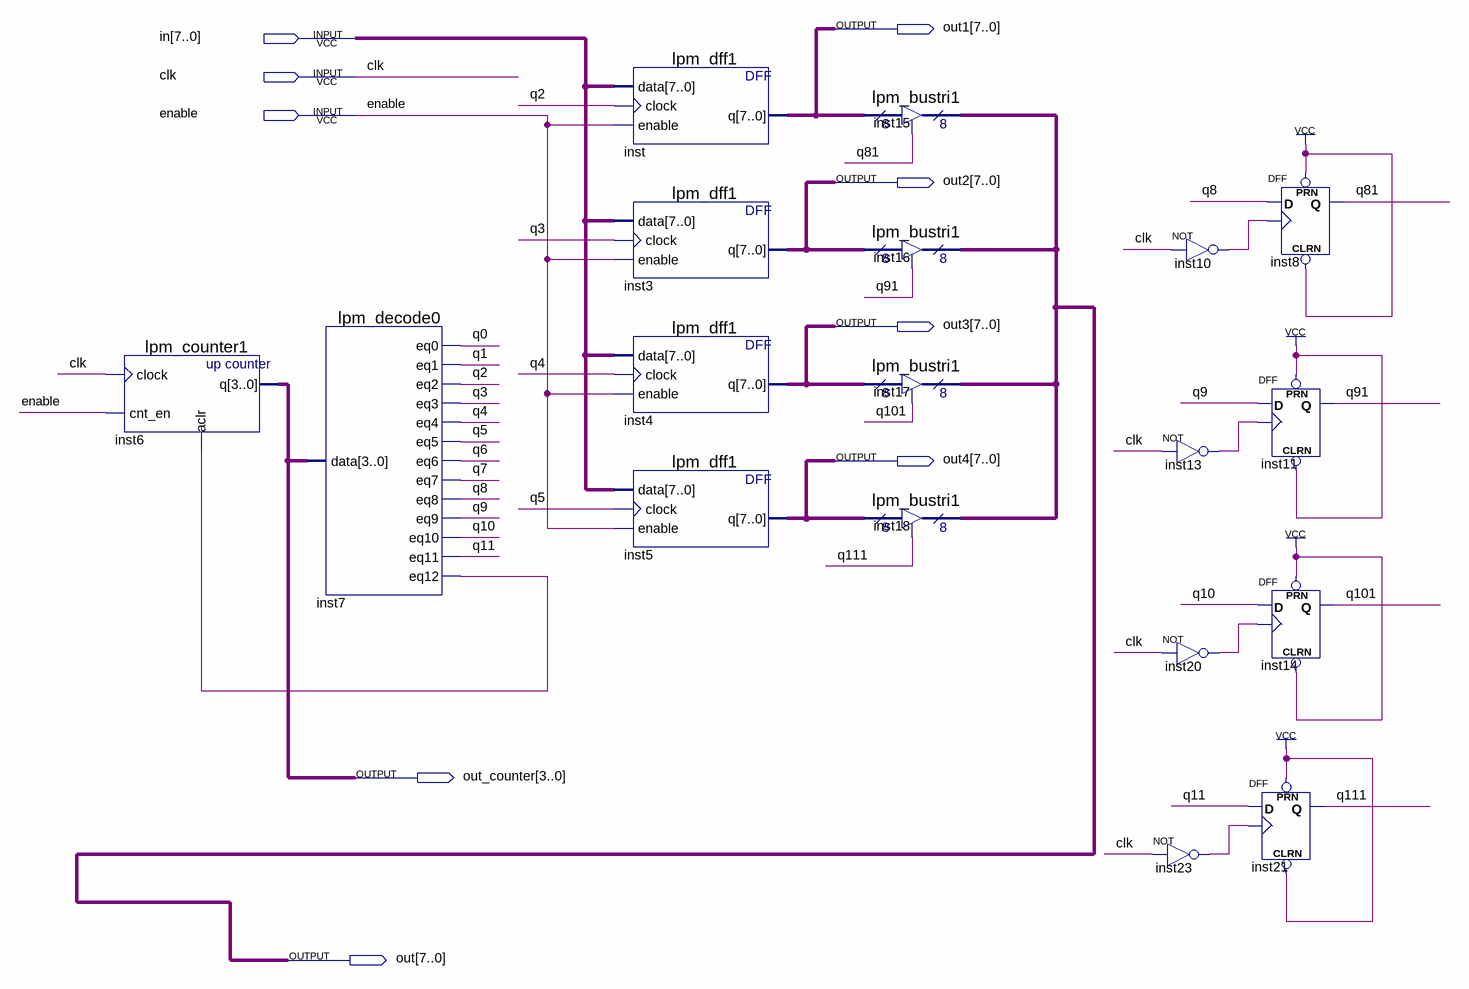
[diagram p0: schematic sheet]
// Quartus schematic TestDFF.bdf as structural Verilog: 18 symbols, 9 pins
module TestDFF (
  input  [7:0] in,
  input  clk,
  input  enable,
  output [7:0] out1,
  output [7:0] out2,
  output [7:0] out3,
  output [7:0] out4,
  output [3:0] out_counter,
  output [7:0] out
);

  wire inst7_eq12, inst10_out, inst13_out, inst20_out, inst23_out, q0, q1, q2, q3, q4, q5, q6, q7, q8, q9,
       q10, q11, q81, q91, q101, q111;

  lpm_counter1 inst6 (.clock(clk), .cnt_en(enable), .aclr(inst7_eq12), .q(out_counter));
  lpm_decode0 inst7 (
    .data(out_counter), .eq0(q0), .eq1(q1), .eq2(q2), .eq3(q3), .eq4(q4), .eq5(q5), .eq6(q6), .eq7(q7),
    .eq8(q8), .eq9(q9), .eq10(q10), .eq11(q11), .eq12(inst7_eq12));
  lpm_dff1 inst (.data(in), .clock(q2), .enable(enable), .q(out1));
  lpm_dff1 inst3 (.data(in), .clock(q3), .enable(enable), .q(out2));
  lpm_dff1 inst4 (.data(in), .clock(q4), .enable(enable), .q(out3));
  lpm_dff1 inst5 (.data(in), .clock(q5), .enable(enable), .q(out4));
  lpm_bustri1 inst15 (.enabledt(q81), .data(out1), .tridata(out));
  lpm_bustri1 inst16 (.enabledt(q91), .data(out2), .tridata(out));
  lpm_bustri1 inst17 (.enabledt(q101), .data(out3), .tridata(out));
  lpm_bustri1 inst18 (.enabledt(q111), .data(out4), .tridata(out));
  not inst23 (inst23_out, clk);
  not inst10 (inst10_out, clk);
  not inst13 (inst13_out, clk);
  not inst20 (inst20_out, clk);
  DFF inst8 (.CLRN(1'b1), .CLK(inst10_out), .D(q8), .PRN(1'b1), .Q(q81));
  DFF inst11 (.CLRN(1'b1), .CLK(inst13_out), .D(q9), .PRN(1'b1), .Q(q91));
  DFF inst14 (.CLRN(1'b1), .CLK(inst20_out), .D(q10), .PRN(1'b1), .Q(q101));
  DFF inst21 (.CLRN(1'b1), .CLK(inst23_out), .D(q11), .PRN(1'b1), .Q(q111));
endmodule
